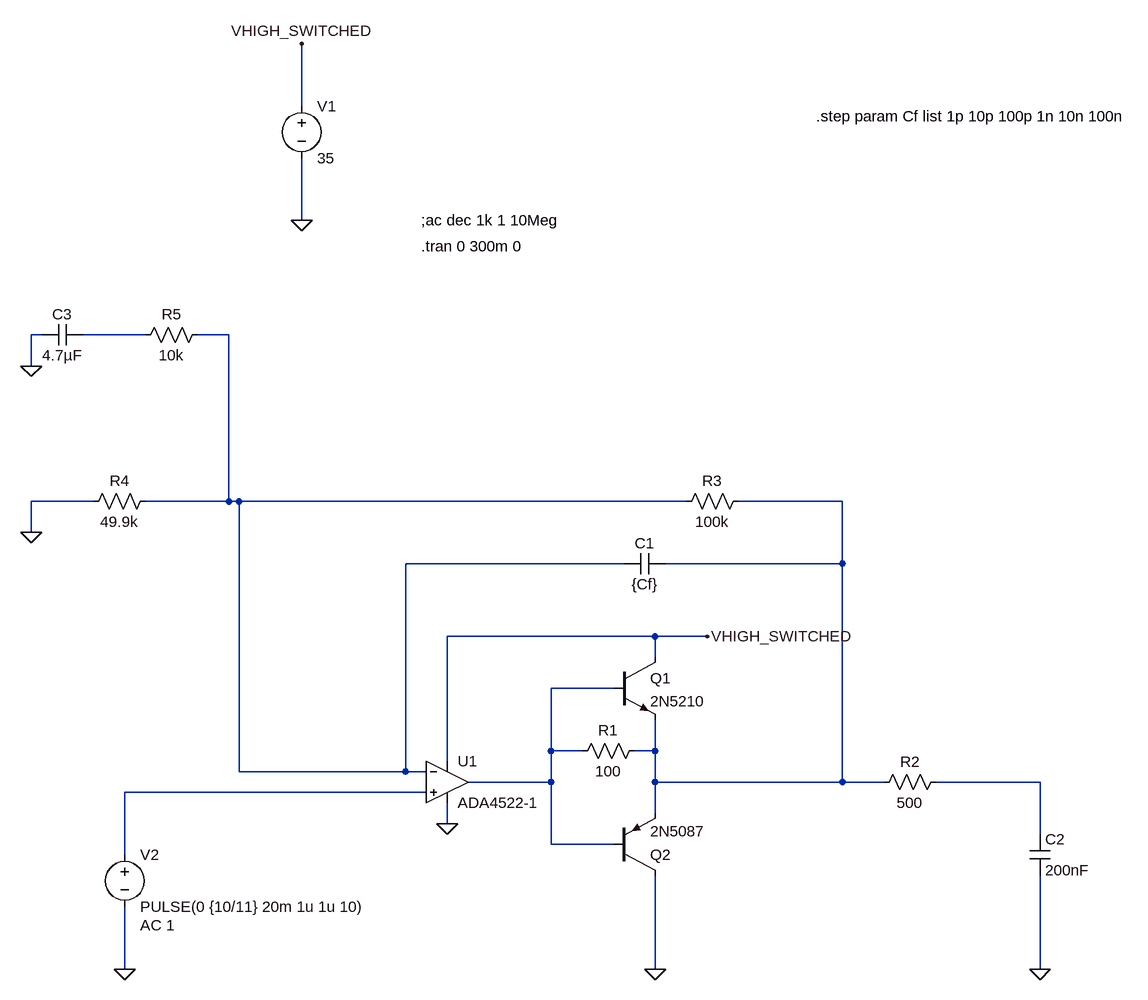
[diagram p0: schematic HV_Power_Amp.asc]
HV_Power_Amp.asc, the LTspice schematic file:
Version 4
SHEET 1 1280 680
WIRE -32 -704 -32 -800
WIRE -32 -528 -32 -624
WIRE -432 -352 -448 -352
WIRE -272 -352 -368 -352
WIRE -144 -352 -192 -352
WIRE -448 -304 -448 -352
WIRE -352 -96 -448 -96
WIRE -144 -96 -144 -352
WIRE -144 -96 -272 -96
WIRE -128 -96 -144 -96
WIRE 560 -96 -128 -96
WIRE 800 -96 640 -96
WIRE -448 -48 -448 -96
WIRE 464 0 128 0
WIRE 800 0 800 -96
WIRE 800 0 528 0
WIRE 512 112 192 112
WIRE 592 112 512 112
WIRE 512 144 512 112
WIRE 448 192 352 192
WIRE 352 288 352 192
WIRE 400 288 352 288
WIRE 512 288 512 240
WIRE 512 288 480 288
WIRE 192 304 192 112
WIRE -128 320 -128 -96
WIRE 128 320 128 0
WIRE 128 320 -128 320
WIRE 160 320 128 320
WIRE 352 336 352 288
WIRE 352 336 224 336
WIRE 512 336 512 288
WIRE 800 336 800 0
WIRE 800 336 512 336
WIRE 864 336 800 336
WIRE 1104 336 944 336
WIRE 160 352 -304 352
WIRE 512 384 512 336
WIRE 192 400 192 368
WIRE 1104 416 1104 336
WIRE 352 432 352 336
WIRE 448 432 352 432
WIRE -304 448 -304 352
WIRE -304 624 -304 528
WIRE 512 624 512 480
WIRE 1104 624 1104 480
FLAG 512 624 0
FLAG 592 112 VHIGH_SWITCHED
FLAG 192 400 0
FLAG -32 -528 0
FLAG -32 -800 VHIGH_SWITCHED
FLAG 1104 624 0
FLAG -304 624 0
FLAG -448 -48 0
FLAG -448 -304 0
SYMBOL npn 448 144 R0
SYMATTR InstName Q1
SYMATTR Value 2N5210
SYMBOL pnp 448 480 M180
SYMATTR InstName Q2
SYMATTR Value 2N5087
SYMBOL Opamps\\ADA4522-1 192 272 R0
SYMATTR InstName U1
SYMBOL res 496 272 R90
WINDOW 0 0 56 VBottom 2
WINDOW 3 32 56 VTop 2
SYMATTR InstName R1
SYMATTR Value 100
SYMBOL cap 528 -16 R90
WINDOW 0 0 32 VBottom 2
WINDOW 3 32 32 VTop 2
SYMATTR InstName C1
SYMATTR Value {Cf}
SYMBOL voltage -32 -720 R0
WINDOW 123 0 0 Left 0
WINDOW 39 0 0 Left 0
SYMATTR InstName V1
SYMATTR Value 35
SYMBOL res 960 320 R90
WINDOW 0 0 56 VBottom 2
WINDOW 3 32 56 VTop 2
SYMATTR InstName R2
SYMATTR Value 500
SYMBOL cap 1088 416 R0
SYMATTR InstName C2
SYMATTR Value 200nF
SYMBOL voltage -304 432 R0
WINDOW 123 24 124 Left 2
WINDOW 39 0 0 Left 0
SYMATTR Value2 AC 1
SYMATTR InstName V2
SYMATTR Value PULSE(0 {10/11} 20m 1u 1u 10)
SYMBOL res 656 -112 R90
WINDOW 0 0 56 VBottom 2
WINDOW 3 32 56 VTop 2
SYMATTR InstName R3
SYMATTR Value 100k
SYMBOL res -256 -112 R90
WINDOW 0 0 56 VBottom 2
WINDOW 3 32 56 VTop 2
SYMATTR InstName R4
SYMATTR Value 49.9k
SYMBOL cap -368 -368 R90
WINDOW 0 0 32 VBottom 2
WINDOW 3 32 32 VTop 2
SYMATTR InstName C3
SYMATTR Value 4.7µF
SYMBOL res -176 -368 R90
WINDOW 0 0 56 VBottom 2
WINDOW 3 32 56 VTop 2
SYMATTR InstName R5
SYMATTR Value 10k
TEXT 152 -528 Left 2 !;ac dec 1k 1 10Meg
TEXT 760 -688 Left 2 !.step param Cf list 1p 10p 100p 1n 10n 100n
TEXT 152 -488 Left 2 !.tran 0 300m 0

The netlist it stands for:
* HV_Power_Amp.asc
Q1 VHIGH_SWITCHED N004 N003 0 2N5210
Q2 0 N004 N003 0 2N5087
XU1 N006 N002 VHIGH_SWITCHED 0 N004 ADA4522-1  ; pins In+ In- V+ V- OUT
R1 N003 N004 100
C1 N003 N002 {Cf}
V1 VHIGH_SWITCHED 0 35
R2 N005 N003 500
C2 N005 0 200nF
V2 N006 0 PULSE(0 {10/11} 20m 1u 1u 10) AC 1
R3 N003 N002 100k
R4 N002 0 49.9k
C3 N001 0 4.7µF
R5 N002 N001 10k
.model NPN NPN
.model PNP PNP
.lib standard.bjt
;ac dec 1k 1 10Meg
.step param Cf list 1p 10p 100p 1n 10n 100n
.tran 0 300m 0
.backanno
.end